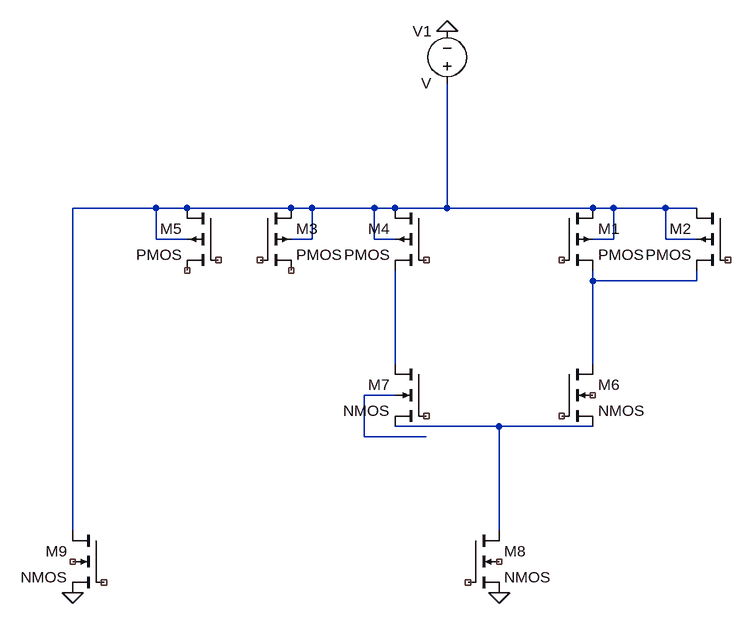
[diagram p0: schematic Draft5.asc]
Draft5.asc, the LTspice schematic file:
Version 4
SHEET 1 880 680
WIRE -384 48 -512 48
WIRE -336 48 -384 48
WIRE -176 48 -336 48
WIRE -144 48 -176 48
WIRE -48 48 -144 48
WIRE -16 48 -48 48
WIRE 64 48 64 -144
WIRE 64 48 -16 48
WIRE 288 48 64 48
WIRE 320 48 288 48
WIRE 400 48 320 48
WIRE 448 48 400 48
WIRE -384 96 -384 48
WIRE -336 96 -384 96
WIRE -144 96 -144 48
WIRE -144 96 -176 96
WIRE -48 96 -48 48
WIRE -16 96 -48 96
WIRE 320 96 320 48
WIRE 320 96 288 96
WIRE 400 96 400 48
WIRE 448 96 400 96
WIRE 288 160 288 144
WIRE 448 160 448 144
WIRE 448 160 288 160
WIRE -16 288 -16 144
WIRE 288 288 288 160
WIRE -16 336 -64 336
WIRE 144 384 -16 384
WIRE 288 384 144 384
WIRE -64 400 -64 336
WIRE 32 400 -64 400
WIRE -512 544 -512 48
WIRE 144 544 144 384
FLAG -512 640 0
FLAG 144 640 0
FLAG 64 -224 0
SYMBOL pmos4 240 48 R0
SYMATTR InstName M1
SYMBOL pmos4 496 48 M0
SYMATTR InstName M2
SYMBOL pmos4 -224 48 R0
SYMATTR InstName M3
SYMBOL pmos4 32 48 M0
SYMATTR InstName M4
SYMBOL pmos4 -288 48 M0
SYMATTR InstName M5
SYMBOL voltage 64 -128 R180
WINDOW 0 24 96 Left 2
WINDOW 3 24 16 Left 2
SYMATTR InstName V1
SYMBOL nmos4 240 288 R0
SYMATTR InstName M6
SYMBOL nmos4 32 288 M0
SYMATTR InstName M7
SYMBOL nmos4 96 544 R0
SYMATTR InstName M8
SYMBOL nmos4 -464 544 M0
SYMATTR InstName M9

The netlist it stands for:
* Draft5.asc
M1 N001 NC_01 N002 N001 PMOS
M2 N001 NC_02 N002 N001 PMOS
M3 N001 NC_03 NC_04 N001 PMOS
M4 N001 NC_05 N003 N001 PMOS
M5 N001 NC_06 NC_07 N001 PMOS
V1 N001 0 V
M6 N002 NC_08 N005 NC_09 NMOS
M7 N003 NC_10 N005 N004 NMOS
M8 N005 NC_11 0 NC_12 NMOS
M9 N001 NC_13 0 NC_14 NMOS
.model NMOS NMOS
.model PMOS PMOS
.lib standard.mos
.backanno
.end